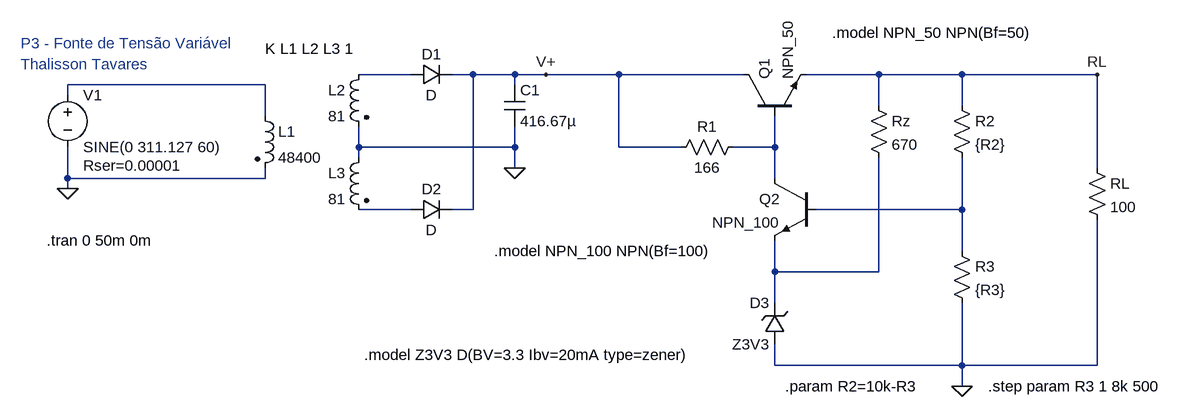
[diagram p0: schematic P3 - Regulated power supply.asc]
P3 - Regulated power supply.asc, the LTspice schematic file:
Version 4
SHEET 1 1868 904
WIRE 624 96 544 96
WIRE 720 96 688 96
WIRE 784 96 720 96
WIRE 832 96 784 96
WIRE 944 96 832 96
WIRE 1136 96 944 96
WIRE 1344 96 1232 96
WIRE 1472 96 1344 96
WIRE 1680 96 1472 96
WIRE 400 112 96 112
WIRE 784 112 784 96
WIRE 96 128 96 112
WIRE 1344 144 1344 96
WIRE 1472 144 1472 96
WIRE 400 160 400 112
WIRE 544 208 544 176
WIRE 784 208 784 176
WIRE 784 208 544 208
WIRE 944 208 944 96
WIRE 1040 208 944 208
WIRE 1184 208 1184 160
WIRE 1184 208 1120 208
WIRE 544 224 544 208
WIRE 784 240 784 208
WIRE 1680 240 1680 96
WIRE 96 256 96 208
WIRE 400 256 400 240
WIRE 400 256 96 256
WIRE 1184 256 1184 208
WIRE 96 272 96 256
WIRE 624 304 544 304
WIRE 720 304 720 96
WIRE 720 304 688 304
WIRE 1472 304 1472 224
WIRE 1472 304 1248 304
WIRE 1472 368 1472 304
WIRE 1184 400 1184 352
WIRE 1344 400 1344 224
WIRE 1344 400 1184 400
WIRE 1184 448 1184 400
WIRE 1184 544 1184 512
WIRE 1472 544 1472 448
WIRE 1472 544 1184 544
WIRE 1680 544 1680 320
WIRE 1680 544 1472 544
WIRE 1472 576 1472 544
FLAG 96 272 0
FLAG 784 240 0
FLAG 832 96 V+
FLAG 1472 576 0
FLAG 1680 96 RL
SYMBOL voltage 96 112 R0
WINDOW 123 0 0 Left 0
WINDOW 39 24 124 Left 2
SYMATTR SpiceLine Rser=0.00001
SYMATTR InstName V1
SYMATTR Value SINE(0 311.127 60)
SYMBOL ind2 384 144 R0
SYMATTR InstName L1
SYMATTR Value 48400
SYMATTR Type ind
SYMBOL ind2 560 80 M0
SYMATTR InstName L2
SYMATTR Value 81
SYMATTR Type ind
SYMBOL ind2 560 208 M0
SYMATTR InstName L3
SYMATTR Value 81
SYMATTR Type ind
SYMBOL diode 624 112 R270
WINDOW 0 32 32 VTop 2
WINDOW 3 0 32 VBottom 2
SYMATTR InstName D1
SYMBOL diode 624 320 R270
WINDOW 0 32 32 VTop 2
WINDOW 3 0 32 VBottom 2
SYMATTR InstName D2
SYMBOL cap 768 112 R0
SYMATTR InstName C1
SYMATTR Value 416.67µ
SYMBOL npn 1136 160 R270
SYMATTR InstName Q1
SYMATTR Value NPN_50
SYMBOL npn 1248 256 M0
SYMATTR InstName Q2
SYMATTR Value NPN_100
SYMBOL res 1136 192 R90
WINDOW 0 0 56 VBottom 2
WINDOW 3 32 56 VTop 2
SYMATTR InstName R1
SYMATTR Value 166
SYMBOL res 1456 128 R0
SYMATTR InstName R2
SYMATTR Value {R2}
SYMBOL res 1456 352 R0
SYMATTR InstName R3
SYMATTR Value {R3}
SYMBOL res 1328 128 R0
SYMATTR InstName Rz
SYMATTR Value 670
SYMBOL res 1664 224 R0
SYMATTR InstName RL
SYMATTR Value 100
SYMBOL zener 1200 512 R180
WINDOW 0 24 64 Left 2
WINDOW 3 24 0 Left 2
SYMATTR InstName D3
SYMATTR Value Z3V3
TEXT 400 56 Left 2 !K L1 L2 L3 1
TEXT 24 48 Left 2 ;P3 - Fonte de Tensão Variável
TEXT 24 80 Left 2 ;Thalisson Tavares
TEXT 64 352 Left 2 !.tran 0 50m 0m
TEXT 552 528 Left 2 !.model Z3V3 D(BV=3.3 Ibv=20mA type=zener)
TEXT 752 368 Left 2 !.model NPN_100 NPN(Bf=100)
TEXT 1272 32 Left 2 !.model NPN_50 NPN(Bf=50)
TEXT 1512 576 Left 2 !.step param R3 1 8k 500
TEXT 1200 576 Left 2 !.param R2=10k-R3

The netlist it stands for:
* P3 - Regulated power supply.asc
V1 N002 0 SINE(0 311.127 60) Rser=0.00001
L1 N002 0 48400
L2 N001 0 81
L3 0 N004 81
D1 N001 V+ D
D2 N004 V+ D
C1 V+ 0 416.67µ
Q1 V+ N003 RL 0 NPN_50
Q2 N003 N005 N006 0 NPN_100
R1 N003 V+ 166
R2 RL N005 {R2}
R3 N005 0 {R3}
Rz RL N006 670
RL RL 0 100
D3 0 N006 Z3V3
.model D D
.lib standard.dio
.model NPN NPN
.model PNP PNP
.lib standard.bjt
K L1 L2 L3 1
* P3 - Fonte de Tensão Variável
* Thalisson Tavares
.tran 0 50m 0m
.model Z3V3 D(BV=3.3 Ibv=20mA type=zener)
.model NPN_100 NPN(Bf=100)
.model NPN_50 NPN(Bf=50)
.step param R3 1 8k 500
.param R2=10k-R3
.backanno
.end